# EAGLE design WIFI-Relay_v0.2 (EAGLE 9.2.0)
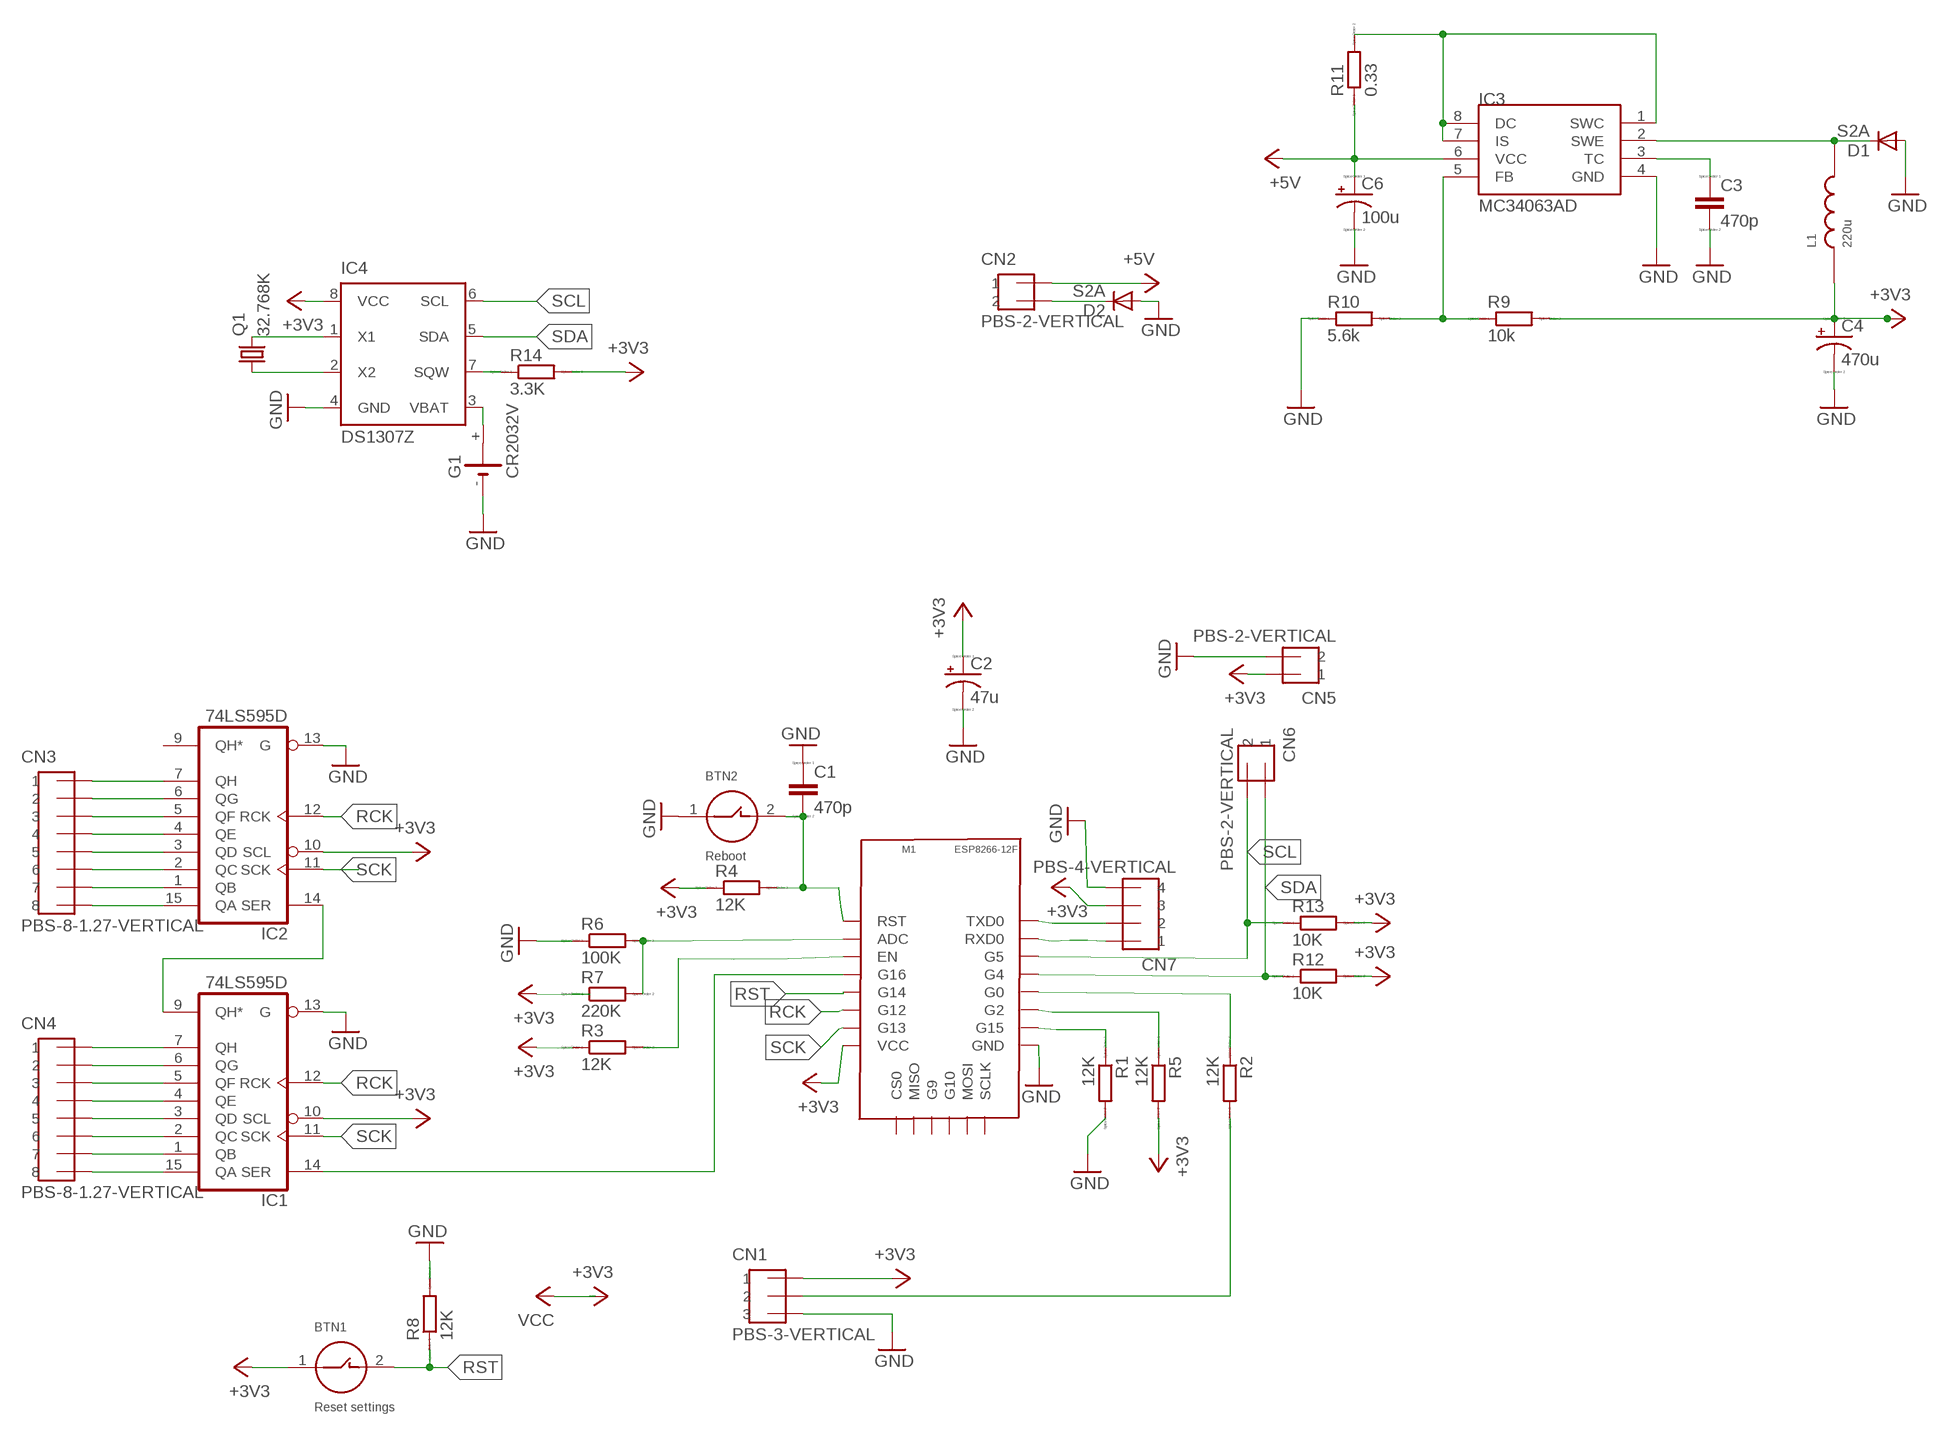
[diagram p0: schematic, sheet 1]

## Parts
BTN1  Reset settings  BTN-6X4-SMD  [BTN-6X4-SMD]
BTN2  Reboot  BTN-6X4-SMD  [BTN-6X4-SMD]
C1  470p  CC0603  [C0603]
C2  47u  CPOL-USCT3216  [CT3216]
C3  470p  CC0603  [C0603]
C4  470u  CPOL-USD/7343-31W  [D/7343-31W]
C6  100u  CPOL-USD/7343-31W  [D/7343-31W]
CN1  PBS-3-VERTICAL  [PBS-3-VERTICAL]
CN2  PBS-2-VERTICAL  [PBS-2-VERTICAL]
CN3  PBS-8-1.27-VERTICAL  [PBS-8-1.27-VERTICAL]
CN4  PBS-8-1.27-VERTICAL  [PBS-8-1.27-VERTICAL]
CN5  PBS-2-VERTICAL  [PBS-2-VERTICAL]
CN6  PBS-2-VERTICAL  [PBS-2-VERTICAL]
CN7  PBS-4-VERTICAL  [PBS-4-VERTICAL]
D1  S2A  [DO214AA]
D2  S2A  [DO214AA]
G1  CR2032V  [CR2032V]
IC1  74LS595D  [SO16]
IC2  74LS595D  [SO16]
IC3  MC34063AD  [SOIC8]
IC4  DS1307Z  [SOIC8]
L1  220u  INDUCTOR-5-10  [INDUCTOR-5-10]
M1  ESP8266-12F  [ESP8266-12F]
Q1  32.768K  CRYSTALTC38H  [TC38H]
R1  12K  RR0603  [R0603]
R2  12K  RR0603  [R0603]
R3  12K  RR0603  [R0603]
R4  12K  RR0603  [R0603]
R5  12K  RR0603  [R0603]
R6  100K  RR0603  [R0603]
R7  220K  RR0603  [R0603]
R8  12K  RR0603  [R0603]
R9  10k  RR0603  [R0603]
R10  5.6k  RR0603  [R0603]
R11  0.33  RR0603  [R0603]
R12  10K  RR0603  [R0603]
R13  10K  RR0603  [R0603]
R14  3.3K  RR0603  [R0603]

## Nets
+3V3: BTN1.1 C2.-(+) C4.+ CN1.P$1 CN5.P$1 CN7.P$3 IC1.10(SCL) IC2.10(SCL) IC4.8(VCC) L1.P$1 M1.VCC R3.1 R4.1 R5.2 R7.1 R9.2 R12.2 R13.2 R14.2 ; supply symbol labelled VCC
+5V: C6.+ CN2.P$1 IC3.6(VCC) R11.1
GND: BTN2.1 C1.1 C2.+(-) C3.2 C4.- C6.- CN1.P$3 CN5.P$2 CN7.P$4 D1.A D2.A G1.- IC1.13(G) IC2.13(G) IC3.4(GND) IC4.4(GND) M1.GND R1.2 R6.1 R8.2 R10.1
N$1: M1.G15 R1.1
N$2: M1.G2 R5.1
N$3: M1.G0 R2.1
N$4: CN1.P$2 R2.2
N$5: M1.EN R3.2
N$6: CN7.P$1 M1.RXD0
N$7: CN7.P$2 M1.TXD0
N$8: CN3.P$1 IC2.7(QH)
N$9: CN3.P$2 IC2.6(QG)
N$10: CN3.P$3 IC2.5(QF)
N$11: CN3.P$4 IC2.4(QE)
N$12: CN3.P$5 IC2.3(QD)
N$13: CN3.P$6 IC2.2(QC)
N$14: CN3.P$7 IC2.1(QB)
N$15: CN3.P$8 IC2.15(QA)
N$16: CN4.P$1 IC1.7(QH)
N$17: CN4.P$2 IC1.6(QG)
N$18: CN4.P$3 IC1.5(QF)
N$19: CN4.P$4 IC1.4(QE)
N$20: CN4.P$5 IC1.3(QD)
N$21: CN4.P$6 IC1.2(QC)
N$22: CN4.P$7 IC1.1(QB)
N$23: CN4.P$8 IC1.15(QA)
N$24: BTN2.2 C1.2 M1.RST R4.2
N$25: IC4.1(X1) Q1.2
N$26: IC1.9(QH*) IC2.14(SER)
N$27: IC1.14(SER) M1.G16
N$28: IC4.2(X2) Q1.1
N$29: M1.ADC R6.2 R7.2
N$30: IC3.5(FB) R9.1 R10.2
N$31: D1.C IC3.2(SWE) L1.P$2
N$32: IC3.1(SWC) IC3.7(IS) IC3.8(DC) R11.2
N$33: C3.1 IC3.3(TC)
N$34: CN2.P$2 D2.C
N$35: IC4.7(SQW) R14.1
N$36: G1.+ IC4.3(VBAT)
RCK: IC1.12(RCK) IC2.12(RCK) M1.G12
RST: BTN1.2 M1.G14 R8.1
SCK: IC1.11(SCK) IC2.11(SCK) M1.G13
SCL: CN6.P$2 IC4.6(SCL) M1.G5 R13.1
SDA: CN6.P$1 IC4.5(SDA) M1.G4 R12.1
Unconnected: G1.+@1(+) IC2.9(QH*) M1.CS0 M1.G9 M1.G10 M1.MISO M1.MOSI M1.SCLK

## Power pins joined to a net without a drawn wire
+3V3: IC1.16(VCC) IC2.16(VCC)
GND: IC1.8(GND) IC2.8(GND)

## Library data of the parts
BTN1 BTN2 = btn1:BTN-6X4-SMD
C1 C3 = eagle-ltspice:C: CAPACITOR, European symbol; SPICEMODEL: NONE; SPICEPREFIX: C
C2 C4 C6 = resistor:CPOL-US: POLARIZED CAPACITOR, American symbol
CN1 = pls:PBS-3-VERTICAL
CN2 CN5 CN6 = pls:PBS-2-VERTICAL
CN3 CN4 = pls:PBS-8-1.27-VERTICAL
CN7 = pls:PBS-4-VERTICAL
D1 D2 = s2x_10:S2*: S2A - S2M General Purpose Rectifiers Source: http://www.fairchildsemi.com/datasheets/S2/S2A.pdf; MF: Fairchild; MPN: S2A; OC_FARNELL: 1467485; OC_NEWARK: 58K2391
G1 = battery:CR2032V: LI BATTERY Varta
IC1 IC2 = 74xx-us:74*595: 8-bit SHIFT REGISTER, output latch
IC3 = mc34063:MC34063
IC4 = ds1307_pcf8583:DS1307: I2C-Bus CLOCK/CALENDAR
L1 = inductor:INDUCTOR-5-10
M1 = ESP8266-12F:ESP8266-12F: ESP8266-12F Author: Konstantin Polyakov Date: March, 2018
Q1 = crystal:CRYSTAL: CRYSTAL; OC_FARNELL: unknown; OC_NEWARK: unknown
R1-R14 = eagle-ltspice:R: RESISTOR, European symbol; SPICEMODEL: NONE; SPICEPREFIX: R

## Board
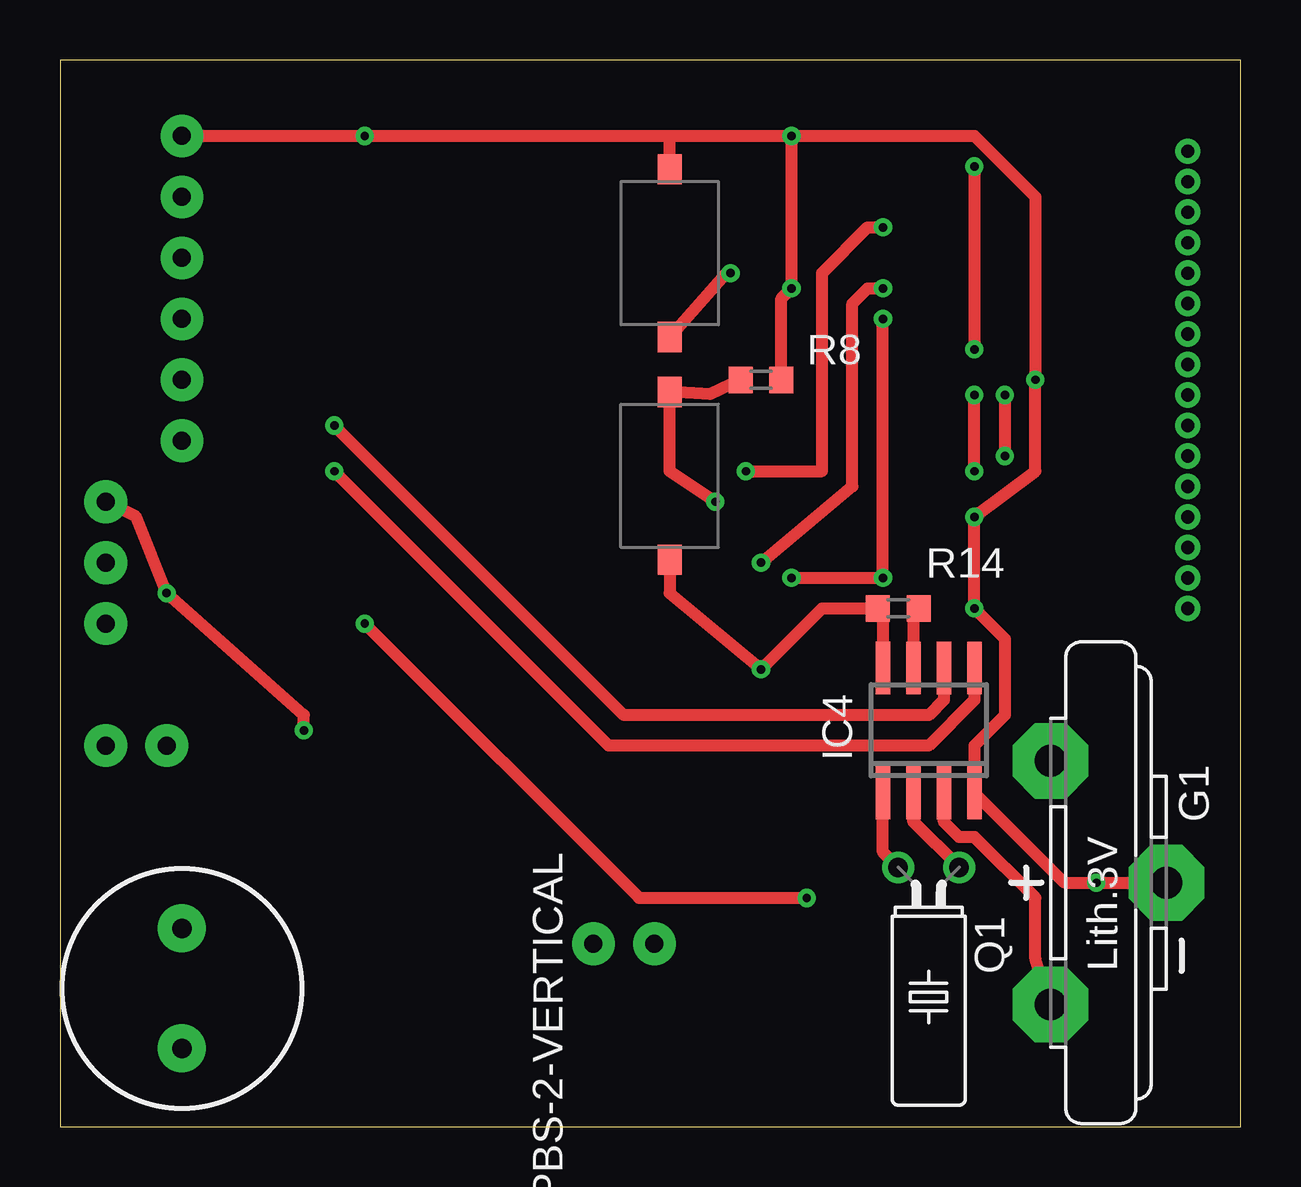
[diagram p1: board, top side]
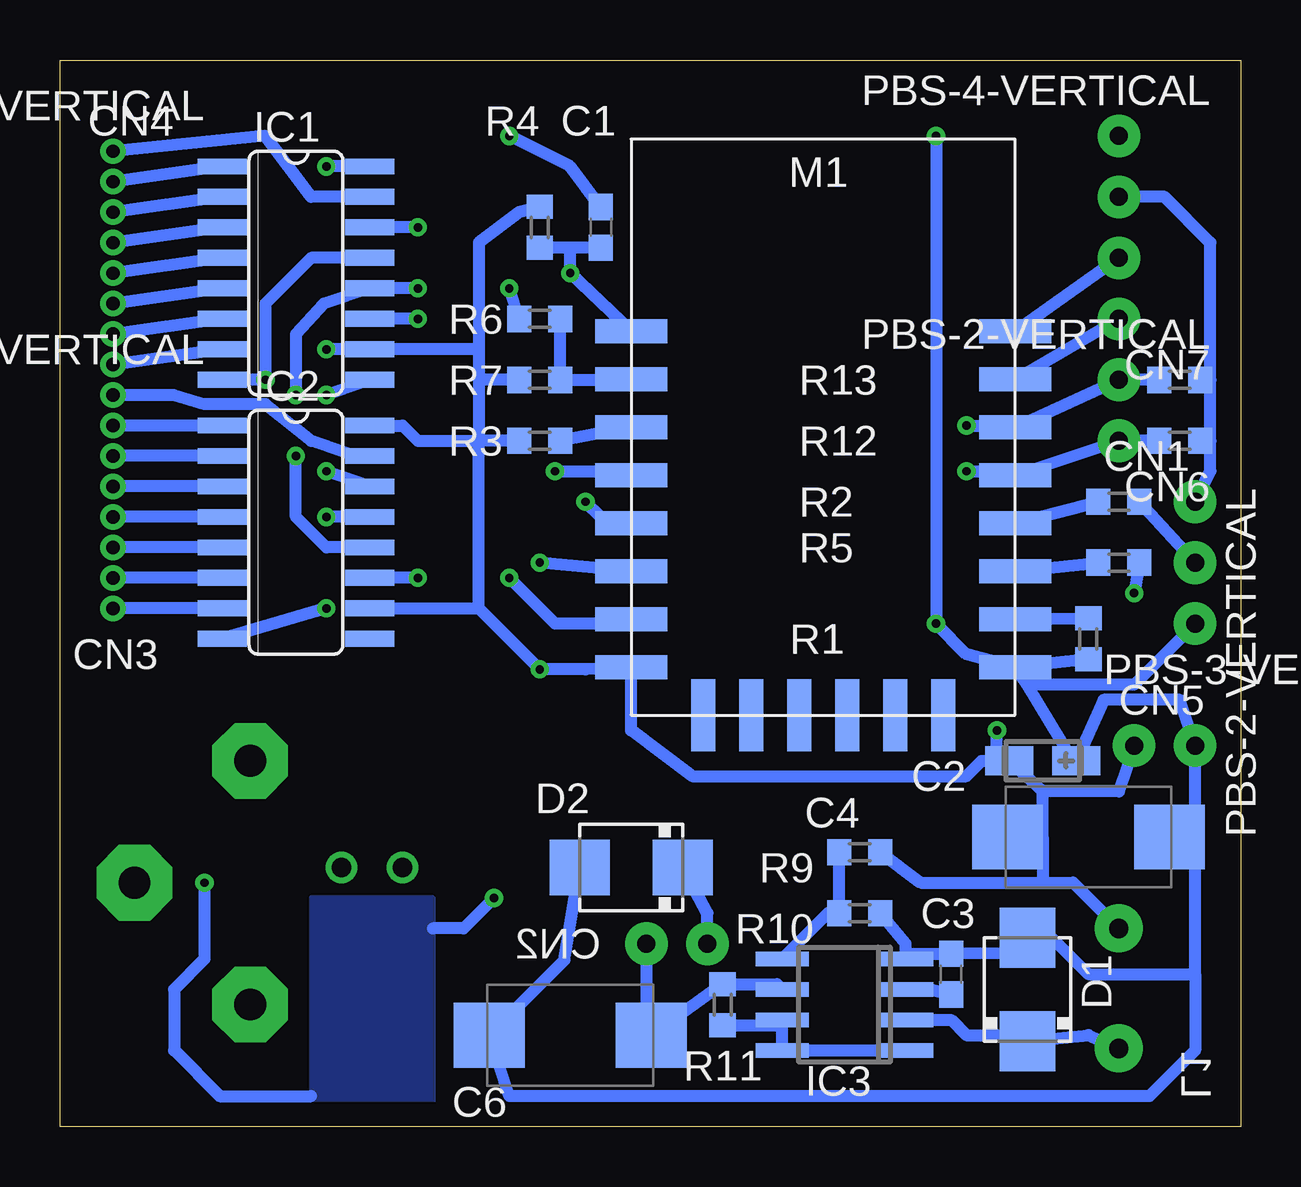
[diagram p2: board, bottom side, seen from below]

Size 49.2 x 44.44 mm. Coordinates in mm from the lower left corner, seen from the top.
Outline: 0,0 49.2,0 49.2,44.44 0,44.44 0,0
Copper layers (1*16): Top 0.035mm / dielectric 1.5mm / Bottom 0.035mm
Design rules "default": minimum track width 6mil, minimum drill 0.35mm, track to track 6mil, track to pad 6mil, pad to pad 6mil, via to via 6mil, smd to smd 6mil, copper to edge 40mil, drill to drill 6mil, minimum pad ring 10mil, minimum via ring 8mil, stop-mask expansion 4mil, vias tented up to drill 0mil, thermal gap 10mil

### Footprints (pad centres in the part's own frame; a part is rotated, then mirrored left to right if it is on the bottom)
BTN-6X4-SMD = smd 1.25 x 1: 1 -0.508,0 | smd 1.27 x 1: 2 6.477,0
C0603 = smd 1.1 x 1: 1 -0.85,0; 2 0.85,0
CT3216 = smd 2 x 1.2: + -1.4,0; - 1.4,0
D/7343-31W = smd 2.95 x 2.7: + 3.375,0; - -3.375,0
PBS-3-VERTICAL = drill 0.75 pad 1.778: P$1 0,0; P$2 0,-2.54; P$3 0,-5.08
PBS-2-VERTICAL = drill 0.75 pad 1.778: P$1 0,0; P$2 0,-2.54
PBS-8-1.27-VERTICAL = drill 0.55 pad 1: P$1 0,0; P$2 0,-1.27; P$3 0,-2.54; P$4 0,-3.81; P$5 0,-5.08; P$6 0,-6.35; P$7 0,-7.62; P$8 0,-8.89
PBS-4-VERTICAL = drill 0.75 pad 1.778: P$1 0,0; P$2 0,-2.54; P$3 0,-5.08; P$4 0,-7.62
DO214AA = smd 2.5 x 2.3: A 2.15,0; C -2.15,0
CR2032V = drill 1.321 pad 3.15 octagon: + -2.54,-5.08; +@1 -2.54,5.08; - 2.286,0
SO16 = smd 0.66 x 2.032: 1 -4.445,-3.073; 2 -3.175,-3.073; 3 -1.905,-3.073; 4 -0.635,-3.073; 5 0.635,-3.073; 6 1.905,-3.073; 7 3.175,-3.073; 8 4.445,-3.073; 9 4.445,3.073; 10 3.175,3.073; 11 1.905,3.073; 12 0.635,3.073; 13 -0.635,3.073; 14 -1.905,3.073; 15 -3.175,3.073; 16 -4.445,3.073
SOIC8 = smd 0.6 x 2.2: 1 -1.905,-2.6; 2 -0.635,-2.6; 3 0.635,-2.6; 4 1.905,-2.6; 5 1.905,2.6; 6 0.635,2.6; 7 -0.635,2.6; 8 -1.905,2.6
INDUCTOR-5-10 = drill 0.8 pad 2: P$1 0,0; P$2 5,0
ESP8266-12F = smd 3 x 1: ADC 0,14; EN 0,12; G0 16,8; G2 16,6; G4 16,10; G5 16,12; G12 0,6; G13 0,4; G14 0,8; G15 16,4; G16 0,10; GND 16,2; RST 0,16; RXD0 16,14; TXD0 16,16; VCC 0,2 | smd 1 x 3: CS0 3,0; G9 7,0; G10 9,0; MISO 5,0; MOSI 11,0; SCLK 13,0
TC38H = drill 0.813: 1 -1.27,0; 2 1.27,0
R0603 = smd 1 x 1.1: 1 -0.85,0; 2 0.85,0

### Placement (x,y rotation side)
BTN1  25.4,24.13 90 top
BTN2  25.4,39.37 270 top
C1  26.67,37.47 270 bottom
C2  8.26,15.24 180 bottom
C3  12.06,6.35 90 bottom
C4  6.35,12.06 180 bottom
C6  27.94,3.81 0 bottom
CN1  1.91,26.04 0 bottom
CN2  24.77,7.62 270 top
CN3  46.99,21.59 180 bottom
CN4  46.99,31.75 180 bottom
CN5  4.45,15.88 90 bottom
CN6  5.08,28.57 180 bottom
CN7  5.08,33.66 180 bottom
D1  8.89,5.71 90 bottom
D2  25.4,10.79 180 bottom
G1  43.81,10.16 0 top
IC1  39.37,35.56 270 bottom
IC2  39.37,24.77 270 bottom
IC3  16.51,5.08 90 bottom
IC4  36.2,16.51 0 top
L1  5.08,8.26 270 top
M1  25.4,17.14 0 bottom
Q1  36.2,10.79 180 top
R1  6.35,20.32 270 bottom
R2  5.08,26.04 0 bottom
R3  29.21,28.57 0 bottom
R4  29.21,37.47 270 bottom
R5  5.08,23.5 0 bottom
R6  29.21,33.66 0 bottom
R7  29.21,31.11 0 bottom
R8  29.21,31.11 0 top
R9  15.88,11.43 0 bottom
R10  15.88,8.89 180 bottom
R11  21.59,5.08 270 bottom
R12  2.54,28.57 0 bottom
R13  2.54,31.11 0 bottom
R14  34.92,21.59 180 top

### Tracks (layer width: path | path; a pad name or v marks a point on that pad's centre or on a via)
+3V3  (via drill 0.35)
  Top 0.5: v38.1,40.01 v38.1,32.38 | BTN1.1 25.4,22.23 v29.21,19.05 31.75,21.59 R14.2 34.29,21.38 IC4.8 | CN1.P$1 3.17,25.4 v4.45,22.23 10.16,17.14 v10.16,16.51
  Bottom 0.5: R3.1 31.75,28.57 | R4.1 30.06,38.1 31.75,36.83 31.75,32.38 | IC2.16 34.92,29.21 34.29,28.57 31.75,28.57 | 36.83,40.01 IC1.16 v38.1,40.01 | R5.2 v4.45,22.23 | 31.75,21.59 31.75,28.57 | 31.75,31.11 31.75,28.57 | 31.75,32.38 31.75,31.11 | R9.2 13.34,10.16 8.26,10.16 | 8.26,10.16 6.99,10.16 L1.P$1 | CN5.P$1 5.08,13.97 8.26,13.97 | C2.- 8.26,13.97 | 8.26,10.16 8.26,12.05 C4.+ 8.26,12.08 8.26,13.97 | R7.1 31.75,31.11 | 31.75,32.38 IC1.10 v38.1,32.38 | 31.75,21.59 v29.21,19.05 27.3,19.05 M1.VCC 25.4,16.51 22.86,14.61 11.43,14.61 10.79,15.24 C2.- | IC2.10 31.75,21.59 | CN1.P$1 1.27,27.3 1.27,28.57 | 1.27,28.57 1.27,31.11 | 1.27,31.11 1.27,36.83 3.17,38.73 CN7.P$3 | R13.2 1.27,31.11 | R12.2 1.27,28.57 | C2.- 10.16,15.74 v10.16,16.51
+5V
  Bottom 0.5: IC3.6 19.32,5.93 R11.1 21.48,6.04 C6.+ 24.77,5.08 CN2.P$1
GND  (via drill 0.35)
  Top 0.5: v30.48,41.27 v30.48,34.92 30.06,34.51 R8.2 | 25.4,41.27 v12.7,41.27 CN7.P$4 | 25.4,41.27 v30.48,41.27 | v30.48,41.27 38.1,41.27 40.64,38.73 v40.64,31.11 40.64,27.3 v38.1,25.4 v38.1,21.59 39.37,20.32 39.37,17.14 38.1,15.88 IC4.4 41.85,10.16 v43.18,10.16 G1.- | BTN2.1 25.4,41.27 | v12.7,20.95 24.13,9.53 v31.11,9.53
  Bottom 0.5: R1.2 M1.GND | R6.1 v30.48,34.92 | C1.1 27.94,40.01 v30.48,41.27 | v38.1,21.59 IC2.8 | IC1.13 38.73,36.2 40.64,34.29 v40.64,31.11 IC1.8 | M1.GND 11.43,19.68 v12.7,20.95 v12.7,41.27 | 8.89,18.41 M1.GND | CN1.P$3 4.45,18.41 8.89,18.41 | IC2.13 v38.1,25.4 | R10.1 13.97,7.62 13.97,7.04 IC3.4 13.7,7.2 C3.2 9.49,7.23 D1.A 8.5,8.5 6.35,6.35 1.91,6.35 | 1.91,6.35 1.91,3.17 3.81,1.27 30.48,1.27 C6.- | 1.91,6.35 1.91,11.43 | 1.91,11.43 CN5.P$2 2.54,17.78 5.71,17.78 C2.+ 6.99,15.24 8.89,18.41 | 1.91,11.43 C4.- | D2.A 28.18,6.94 C6.- | C6.- 31.95,4.45 | v31.11,9.53 32.38,8.26 33.66,8.26 | 38.73,1.27 42.55,1.27 44.45,3.17 44.45,5.71 43.18,6.99 v43.18,10.16
  pour Bottom: 33.66,9.53 38.73,9.53 38.73,0.64 33.66,0.64
N$1
  Bottom 0.5: M1.G15 R1.1
N$2
  Bottom 0.5: M1.G2 R5.1
N$3
  Bottom 0.5: M1.G0 R2.1
N$4
  Bottom 0.5: CN1.P$2 R2.2
N$5
  Bottom 0.5: M1.EN R3.2
N$6
  Bottom 0.5: M1.RXD0 CN7.P$1
N$7
  Bottom 0.5: M1.TXD0 CN7.P$2
N$8
  Bottom 0.5: IC2.7 CN3.P$1
N$9
  Bottom 0.5: IC2.6 CN3.P$2
N$10
  Bottom 0.5: IC2.5 CN3.P$3
N$11
  Bottom 0.5: IC2.4 CN3.P$4
N$12
  Bottom 0.5: IC2.3 CN3.P$5
N$13
  Bottom 0.5: IC2.2 CN3.P$6
N$14
  Bottom 0.5: IC2.1 CN3.P$7
N$15
  Bottom 0.5: IC2.15 36.93,27.94 38.73,28.57 40.64,30.1 43.18,30.1 44.45,30.48 CN3.P$8
N$16
  Bottom 0.5: IC1.7 CN4.P$1
N$17
  Bottom 0.5: IC1.6 CN4.P$2
N$18
  Bottom 0.5: IC1.5 CN4.P$3
N$19
  Bottom 0.5: IC1.4 CN4.P$4
N$20
  Bottom 0.5: IC1.3 CN4.P$5
N$21
  Bottom 0.5: IC1.2 CN4.P$6
N$22
  Bottom 0.5: IC1.1 CN4.P$7
N$23
  Bottom 0.5: IC1.15 38.73,38.73 40.64,41.27 CN4.P$8
N$24  (via drill 0.35)
  Top 0.5: BTN2.2 27.77,35.56 v27.94,35.56
  Bottom 0.5: C1.2 27.94,36.62 | 27.94,36.62 R4.2 | M1.RST v27.94,35.56 27.94,36.62
N$25
  Top 0.5: Q1.2 34.29,11.43 IC4.1
N$26  (via drill 0.35)
  Top 0.5: v38.1,27.3 v38.1,30.48
  Bottom 0.5: IC2.14 v38.1,27.3 | IC1.9 v38.1,30.48
N$27  (via drill 0.35)
  Top 0.5: v28.57,27.3 31.75,27.3 31.75,35.56 33.66,37.47 v34.29,37.47
  Bottom 0.5: v34.29,37.47 IC1.14 | v28.57,27.3 25.56,27.3 M1.G16
N$28
  Top 0.5: Q1.1 35.56,12.7 IC4.2
N$29
  Bottom 0.5: R6.2 R7.2 26.67,31.11 26.64,31.14 M1.ADC
N$30
  Bottom 0.5: 19.27,6.99 IC3.5 | 19.05,6.99 IC3.5 | IC3.5 17.2,8.89 R10.2 R9.1
N$31
  Bottom 0.5: IC3.2 12.06,4.45 11.43,3.81 10.16,3.81 D1.C 6.35,3.81 L1.P$2
N$32
  Bottom 0.5: IC3.1 IC3.8 IC3.7 19.32,4.23 R11.2
N$33
  Bottom 0.5: IC3.3 12.91,5.71 C3.1
N$34
  Bottom 0.5: CN2.P$2 22.23,8.89 D2.C
N$35
  Top 0.5: R14.1 35.56,21.38 IC4.7
N$36
  Top 0.5: G1.+ 40.64,6.99 40.64,9.53 38.1,12.06 37.47,12.06 36.83,12.7 IC4.3
RCK  (via drill 0.35)
  Top 0.5: v29.21,23.5 33.02,26.67 33.02,34.29 33.66,34.92 v34.29,34.92 | v39.37,30.48 v39.37,27.94
  Bottom 0.5: M1.G12 v29.21,23.5 | v34.29,34.92 IC1.12 38.2,34.29 39.37,33.02 v39.37,30.48 | IC2.12 38.1,24.13 39.37,25.4 v39.37,27.94
RST  (via drill 0.35)
  Top 0.5: v27.3,26.04 25.4,27.3 BTN1.2 27.09,30.52 R8.1
  Bottom 0.5: v27.3,26.04 26.67,25.4 25.66,25.4 M1.G14
SCK  (via drill 0.35)
  Top 0.5: v30.48,22.86 v34.29,22.86 v34.29,33.66
  Bottom 0.5: M1.G13 25.84,20.95 28.57,20.95 v30.48,22.86 | v34.29,33.66 IC1.11 | v34.29,22.86 IC2.11
SCL  (via drill 0.35)
  Top 0.5: IC4.6 36.83,17.78 36.2,17.14 23.5,17.14 v11.43,29.21
  Bottom 0.5: R13.1 CN6.P$2 M1.G5 9.46,29.21 v11.43,29.21
SDA  (via drill 0.35)
  Top 0.5: IC4.5 38.1,17.78 36.2,15.88 22.86,15.88 v11.43,27.3
  Bottom 0.5: R12.1 CN6.P$1 M1.G4 9.56,27.3 v11.43,27.3

### Text on the board
tValues: - | Polyakov Konstantin / Russia, Yeysk 2018-04-26 WFR-0-3-1 | + | TX | Reboot | RX | SCL | SDA | | Boot | RST sets | | UART | 16 Channels 1 | 3.3V | - | + | - | + | Power 12V